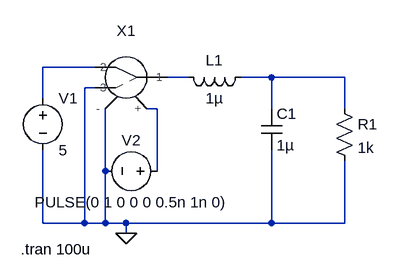
[diagram p0: schematic BuckV2.asc]
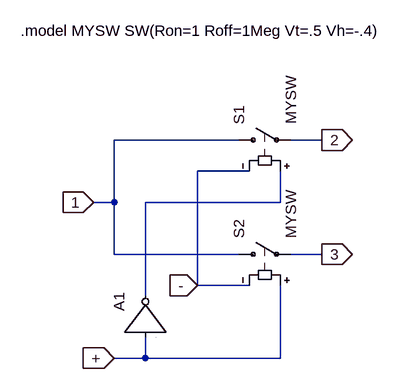
[diagram p1: sub-circuit spdt.asc]
BuckV2.asc, the LTspice schematic file:
Version 4
SHEET 1 880 680
WIRE 48 128 -32 128
WIRE 192 144 160 144
WIRE 320 144 272 144
WIRE 432 144 320 144
WIRE 48 160 32 160
WIRE -32 176 -32 128
WIRE 144 192 128 192
WIRE 320 192 320 144
WIRE 432 192 432 144
WIRE 64 288 64 192
WIRE 144 288 144 192
WIRE -32 368 -32 256
WIRE 32 368 32 160
WIRE 32 368 -32 368
WIRE 64 368 64 288
WIRE 64 368 32 368
WIRE 96 368 64 368
WIRE 320 368 320 256
WIRE 320 368 96 368
WIRE 432 368 432 272
WIRE 432 368 320 368
WIRE 96 384 96 368
FLAG 96 384 0
SYMBOL voltage -32 160 R0
WINDOW 123 0 0 Left 0
WINDOW 39 0 0 Left 0
SYMATTR InstName V1
SYMATTR Value 5
SYMBOL ind 288 128 R90
WINDOW 0 5 56 VBottom 2
WINDOW 3 32 56 VTop 2
SYMATTR InstName L1
SYMATTR Value 1µ
SYMBOL cap 304 192 R0
SYMATTR InstName C1
SYMATTR Value 1µ
SYMBOL res 416 176 R0
SYMATTR InstName R1
SYMATTR Value 1k
SYMBOL SPDT 96 144 M0
SYMATTR InstName X1
SYMBOL voltage 160 288 R90
WINDOW 0 -32 56 VBottom 2
WINDOW 3 32 56 VTop 2
WINDOW 123 0 0 Left 0
WINDOW 39 0 0 Left 0
SYMATTR InstName V2
SYMATTR Value PULSE(0 1 0 0 0 0.5n 1n 0)
TEXT -66 408 Left 2 !.tran 100u

spdt.asc, the sub-circuit schematic file:
Version 4
SHEET 1 880 680
WIRE 192 32 0 32
WIRE 320 32 272 32
WIRE 208 80 128 80
WIRE 0 128 0 32
WIRE 0 128 -32 128
WIRE 256 128 256 80
WIRE 256 128 48 128
WIRE 0 208 0 128
WIRE 192 208 0 208
WIRE 320 208 272 208
WIRE 128 256 128 80
WIRE 208 256 128 256
WIRE 48 272 48 128
WIRE 48 368 48 336
WIRE 48 368 0 368
WIRE 256 368 256 256
WIRE 256 368 48 368
FLAG -32 128 1
IOPIN -32 128 In
FLAG 0 368 +
IOPIN 0 368 In
FLAG 128 256 -
IOPIN 128 256 In
FLAG 320 32 2
IOPIN 320 32 Out
FLAG 320 208 3
IOPIN 320 208 Out
SYMBOL sw 176 32 R270
SYMATTR InstName S1
SYMATTR Value MYSW
SYMBOL sw 176 208 R270
SYMATTR InstName S2
SYMATTR Value MYSW
SYMBOL Digital\\inv -16 336 R270
SYMATTR InstName A1
TEXT -144 -136 Left 2 !.model MYSW SW(Ron=1 Roff=1Meg Vt=.5 Vh=-.4)

The netlist it stands for:
* BuckV2.asc
V1 N001 0 5
L1 N003 N002 1µ
C1 N003 0 1µ
R1 N003 0 1k
XX1 N004 0 N002 N001 0 spdt
V2 N004 0 PULSE(0 1 0 0 0 0.5n 1n 0)

* block symbol definitions
.subckt spdt + - 1 2 3
S1 1 2 N001 - MYSW
S2 1 3 + - MYSW
A1 + 0 0 0 0 N001 0 0 BUF
.model MYSW SW(Ron=1 Roff=1Meg Vt=.5 Vh=-.4)
.ends spdt

.tran 100u
.backanno
.end